# Altium schematic sheet differential_op_amps.SchDoc
size A
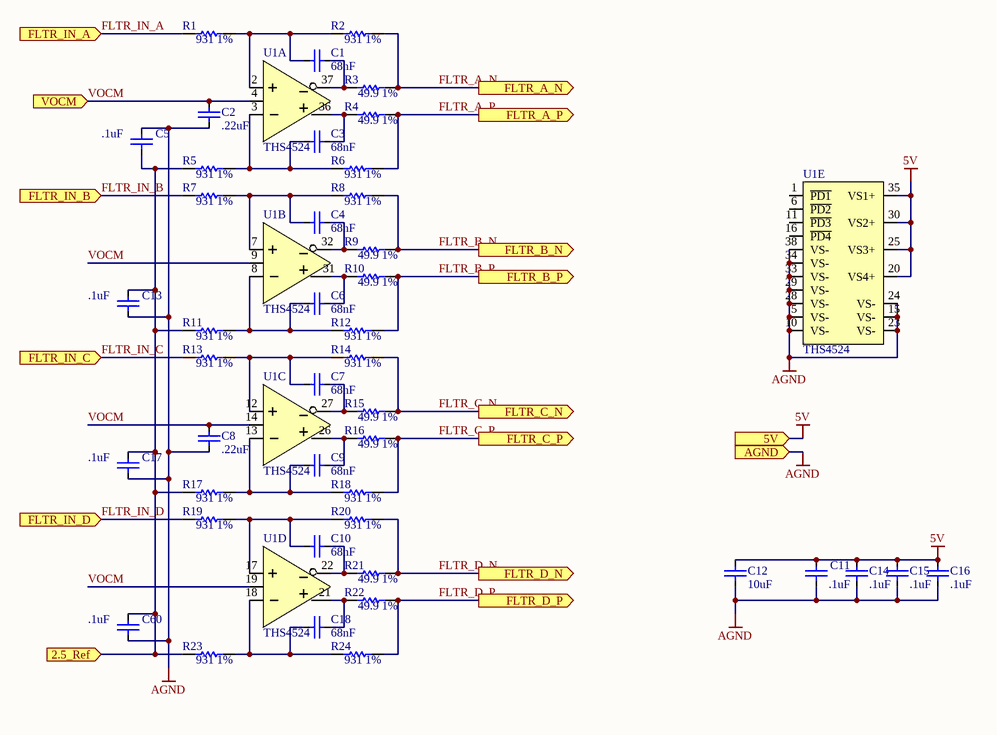
[diagram p0: differential_op_amps.SchDoc]

## Parts
C1  value 68nF  [0603 (1608)]  (hidden comment: Capacitor)
C2  value .22uF  [0603 (1608)]  (hidden comment: Capacitor)
C3  value 68nF  [0603 (1608)]  (hidden comment: Capacitor)
C4  value 68nF  [0603 (1608)]  (hidden comment: Capacitor)
C5  value .1uF  [0603 (1608)]  (hidden comment: Capacitor)
C6  value 68nF  [0603 (1608)]  (hidden comment: Capacitor)
C7  value 68nF  [0603 (1608)]  (hidden comment: Capacitor)
C8  value .22uF  [0603 (1608)]  (hidden comment: Capacitor)
C9  value 68nF  [0603 (1608)]  (hidden comment: Capacitor)
C10  value 68nF  [0603 (1608)]  (hidden comment: Capacitor)
C11  value .1uF  [0603 (1608)]  (hidden comment: Capacitor)
C12  value 10uF  [0603 (1608)]  (hidden comment: Capacitor)
C13  value .1uF  [0603 (1608)]  (hidden comment: Capacitor)
C14  value .1uF  [0603 (1608)]  (hidden comment: Capacitor)
C15  value .1uF  [0603 (1608)]  (hidden comment: Capacitor)
C16  value .1uF  [0603 (1608)]  (hidden comment: Capacitor)
C17  value .1uF  [0603 (1608)]  (hidden comment: Capacitor)
C18  value 68nF  [0603 (1608)]  (hidden comment: Capacitor)
C60  value .1uF  [0603 (1608)]  (hidden comment: Capacitor)
R1  931 1%  [0603 (1608)]
R2  931 1%  [0603 (1608)]
R3  value 49.9 1%  [0603 (1608)]  (hidden comment: 931 1%)
R4  value 49.9 1%  [0603 (1608)]  (hidden comment: 931 1%)
R5  931 1%  [0603 (1608)]
R6  931 1%  [0603 (1608)]
R7  931 1%  [0603 (1608)]
R8  931 1%  [0603 (1608)]
R9  value 49.9 1%  [0603 (1608)]  (hidden comment: 931 1%)
R10  value 49.9 1%  [0603 (1608)]  (hidden comment: 931 1%)
R11  931 1%  [0603 (1608)]
R12  931 1%  [0603 (1608)]
R13  931 1%  [0603 (1608)]
R14  931 1%  [0603 (1608)]
R15  value 49.9 1%  [0603 (1608)]  (hidden comment: 931 1%)
R16  value 49.9 1%  [0603 (1608)]  (hidden comment: 931 1%)
R17  931 1%  [0603 (1608)]
R18  931 1%  [0603 (1608)]
R19  931 1%  [0603 (1608)]
R20  931 1%  [0603 (1608)]
R21  value 49.9 1%  [0603 (1608)]  (hidden comment: 931 1%)
R22  value 49.9 1%  [0603 (1608)]  (hidden comment: 931 1%)
R23  931 1%  [0603 (1608)]
R24  931 1%  [0603 (1608)]
U1  THS4524  [TSSOP-38]  (parts A,B,C,D,E of 5)

## Ports
2.5_Ref (in), 5V (in), AGND (in), FLTR_A_N (out), FLTR_A_P (out), FLTR_B_N (out), FLTR_B_P (out), FLTR_C_N (out), FLTR_C_P (out), FLTR_D_N (out), FLTR_D_P (out), FLTR_IN_A (in), FLTR_IN_B (in), FLTR_IN_C (in), FLTR_IN_D (in), VOCM (in)

## Nets
5V: C11.1 C12.1 C14.1 C15.1 C16.1 U1.20(VS4+) U1.25(VS3+) U1.30(VS2+) U1.35(VS1+) ; port 5V
AGND: C2.1 C5.1 C8.1 C11.2 C12.2 C13.2 C14.2 C15.2 C16.2 C17.2 C60.2 U1.5(VS-) U1.10(VS-) U1.15(VS-) U1.23(VS-) U1.24(VS-) U1.28(VS-) U1.29(VS-) U1.33(VS-) U1.34(VS-) U1.38(VS-) ; port AGND
2.5_Ref: C5.2 C13.1 C17.1 C60.1 R5.1 R11.1 R17.1 R23.1 ; port 2.5_Ref
FLTR_A_N: R2.2 R3.2 ; port FLTR_A_N
FLTR_A_P: R4.2 R6.2 ; port FLTR_A_P
FLTR_B_N: R8.2 R9.2 ; port FLTR_B_N
FLTR_B_P: R10.2 R12.2 ; port FLTR_B_P
FLTR_C_N: R14.2 R15.2 ; port FLTR_C_N
FLTR_C_P: R16.2 R18.2 ; port FLTR_C_P
FLTR_D_N: R20.2 R21.2 ; port FLTR_D_N
FLTR_D_P: R22.2 R24.2 ; port FLTR_D_P
FLTR_IN_A: R1.1 ; port FLTR_IN_A
FLTR_IN_B: R7.1 ; port FLTR_IN_B
FLTR_IN_C: R13.1 ; port FLTR_IN_C
FLTR_IN_D: R19.1 ; port FLTR_IN_D
VOCM: C2.2 C8.2 U1.4(VOCM1) U1.9(VOCM2) U1.14(VOCM3) U1.19(VOCM4) ; port VOCM
NetC1_1: C1.1 R3.1 U1.37(VOUT1-)
NetC1_2: C1.2 R1.2 R2.1 U1.2(VIN1+)
NetC3_1: C3.1 R4.1 U1.36(VOUT1+)
NetC3_2: C3.2 R5.2 R6.1 U1.3(VIN1-)
NetC4_1: C4.1 R9.1 U1.32(VOUT2-)
NetC4_2: C4.2 R7.2 R8.1 U1.7(VIN2+)
NetC6_1: C6.1 R10.1 U1.31(VOUT2+)
NetC6_2: C6.2 R11.2 R12.1 U1.8(VIN2-)
NetC7_1: C7.1 R15.1 U1.27(VOUT3-)
NetC7_2: C7.2 R13.2 R14.1 U1.12(VIN3+)
NetC9_1: C9.1 R16.1 U1.26(VOUT3+)
NetC9_2: C9.2 R17.2 R18.1 U1.13(VIN3-)
NetC10_1: C10.1 R21.1 U1.22(VOUT4_)
NetC10_2: C10.2 R19.2 R20.1 U1.17(VIN4+)
NetC18_1: C18.1 R22.1 U1.21(VOUT4+)
NetC18_2: C18.2 R23.2 R24.1 U1.18(VIN4-)

Not connected (* = marked no-connect by the designer): U1 1(~{PD1}) 6(~{PD2}) 11(~{PD3}) 16(~{PD4})

## Library data of the parts
C1 C3 C4 C6 C7 C9 C10 C18 = Capacitor: Manufacturer: TDK; Part No.: 445-5096-1-ND; Vendor: Digikey; Price Est.: $0.061
C2 C8 = Capacitor: Manufacturer: TDK; Part No.: 445-1318-1-ND; Vendor: Digikey; Price Est.: $0.061
C5 C11 C13-C17 C60 = Capacitor: Manufacturer: Murata; Part No.: 490-1524-1-ND; Vendor: Digikey; Price Est.: $0.019
C12 = Capacitor: Manufacturer: Taiyo Yuden; Part No.: 587-2562-1-ND; Vendor: Digikey; Tolerance: 20%; Price Est.: $0.64
R1 R2 R5-R8 R11-R14 R17-R20 R23 R24 = Res1: Resistor; Part No.: P931HCT-ND; Vendor: Digikey; Value: 931 1%; Price Est.: $0.04
R3 R4 R9 R10 R15 R16 R21 R22 = Res1: Resistor; Part No.: P49.9HCT-ND; Vendor: Digikey; Price Est.: $0.04
U1 = THS4524: Part No.: 296-24315-1-ND; Price Est.: $8.35